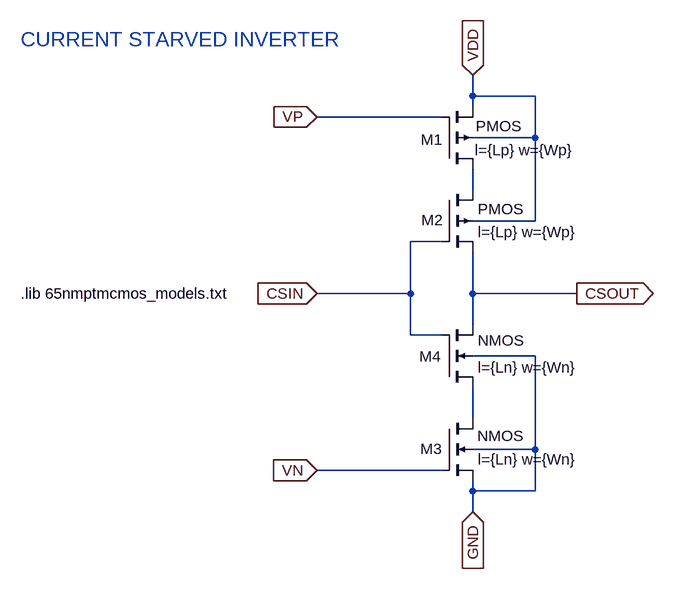
[diagram p0: schematic CS_Inv.asc]
CS_Inv.asc, the LTspice schematic file:
Version 4
SHEET 1 1016 680
WIRE 192 -544 192 -576
WIRE 288 -544 192 -544
WIRE 192 -528 192 -544
WIRE 144 -512 -48 -512
WIRE 288 -480 288 -544
WIRE 288 -480 192 -480
WIRE 192 -400 192 -432
WIRE 288 -352 288 -480
WIRE 288 -352 192 -352
WIRE 144 -320 96 -320
WIRE 96 -240 96 -320
WIRE 96 -240 -48 -240
WIRE 192 -240 192 -304
WIRE 352 -240 192 -240
WIRE 192 -192 192 -240
WIRE 96 -176 96 -240
WIRE 144 -176 96 -176
WIRE 288 -144 192 -144
WIRE 192 -48 192 -96
WIRE 288 0 288 -144
WIRE 288 0 192 0
WIRE 144 32 -48 32
WIRE 192 64 192 48
WIRE 288 64 288 0
WIRE 288 64 192 64
WIRE 192 96 192 64
FLAG 192 -576 VDD
IOPIN 192 -576 In
FLAG 192 96 GND
IOPIN 192 96 In
FLAG -48 -240 CSIN
IOPIN -48 -240 In
FLAG 352 -240 CSOUT
IOPIN 352 -240 Out
FLAG -48 -512 VP
IOPIN -48 -512 In
FLAG -48 32 VN
IOPIN -48 32 In
SYMBOL pmos4 144 -432 M180
WINDOW 123 51 29 Left 2
WINDOW 0 -32 45 Left 2
WINDOW 3 53 66 Left 2
SYMATTR Value2 l={Lp} w={Wp}
SYMATTR InstName M1
SYMBOL pmos4 144 -400 R0
WINDOW 123 56 65 Left 2
WINDOW 0 -31 47 Left 2
WINDOW 3 56 30 Left 2
SYMATTR Value2 l={Lp} w={Wp}
SYMATTR InstName M2
SYMBOL nmos4 144 -48 R0
WINDOW 123 56 63 Left 2
WINDOW 0 -33 47 Left 2
WINDOW 3 55 27 Left 2
SYMATTR Value2 l={Ln} w={Wn}
SYMATTR InstName M3
SYMBOL nmos4 144 -96 M180
WINDOW 123 56 30 Left 2
WINDOW 0 -34 47 Left 2
SYMATTR Value2 l={Ln} w={Wn}
SYMATTR InstName M4
TEXT -504 -240 Left 2 !.lib 65nmptmcmos_models.txt
TEXT -504 -632 Left 3 ;CURRENT STARVED INVERTER

The netlist it stands for:
* CS_Inv.asc
M1 N001 VP VDD VDD PMOS l={Lp} w={Wp}
M2 N001 CSIN CSOUT VDD PMOS l={Lp} w={Wp}
M3 N002 VN GND GND NMOS l={Ln} w={Wn}
M4 N002 CSIN CSOUT GND NMOS l={Ln} w={Wn}
.model NMOS NMOS
.model PMOS PMOS
.lib standard.mos
.lib 65nmptmcmos_models.txt
* CURRENT STARVED INVERTER
.backanno
.end